# Altium schematic sheet Sheet1.SchDoc
size A4
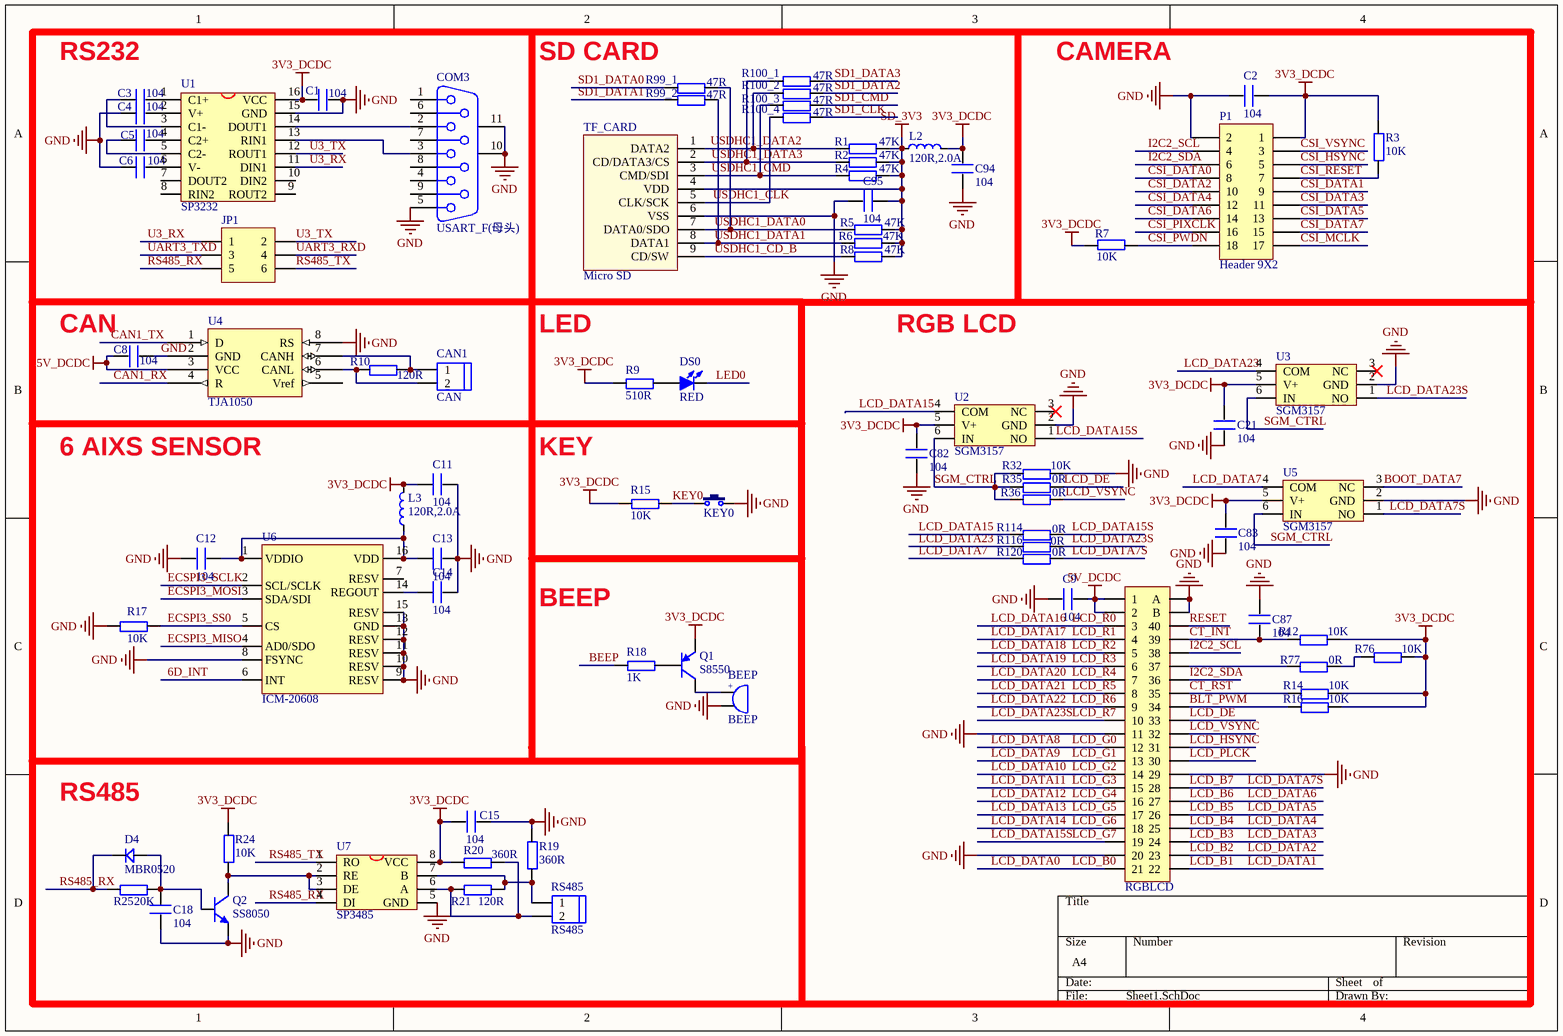
[diagram p0: Sheet1.SchDoc]

## Parts
BEEP  BEEP  [BEEP 5x9x5.5]
C1  104  [C 0603]
C2  104  [C 0603]
C3  104  [C 0603]
C4  104  [C 0603]
C5  104  [C 0603]
C6  104  [C 0603]
C8  104  [C 0603]
C9  104  [C 0603]
C11  104  [C 0603]
C12  104  [C 0603]
C13  104  [C 0603]
C14  104  [C 0603]
C15  104  [C 0603]
C18  104  [C 0603]
C21  104  [C 0603]
C82  104  [C 0603]
C83  104  [C 0603]
C87  104  [C 0603]
C94  104  [C 0603]
C95  104  [C 0603]
CAN1  CAN  [KF301-2P]
COM3  USART_F(母头)  [DB9/P_A]
D4  MBR0520  [SOD-123F]
DS0  RED  [LED 0805R]
JP1  RS232/RS485  [HDR-3X2]  (value not drawn)
KEY0  KEY  [TSW DIP-6*6*5 - 2]  (value not drawn)
L2  120R,2.0A  [L 0603]
L3  120R,2.0A  [L 0603]
P1  Header 9X2  [HDR2X9]
Q1  S8550  [SOT23-3L]
Q2  SS8050  [SOT23-3N]
R1  47K  [R 0603]
R2  47K  [R 0603]
R3  10K  [R 0603]
R4  47K  [R 0603]
R5  47K  [R 0603]
R6  47K  [R 0603]
R7  10K  [R 0603]
R8  47K  [R 0603]
R9  510R  [R 0603]
R10  120R  [R 0603]
R12  10K  [R 0603]
R14  10K  [R 0603]
R15  10K  [R 0603]
R16  10K  [R 0603]
R17  10K  [R 0603]
R18  1K  [R 0603]
R19  360R  [R 0603]
R20  360R  [R 0603]
R21  120R  [R 0603]
R24  10K  [R 0603]
R25  20K  [R 0603]
R32  10K  [R 0603]
R35  0R  [R 0603]
R36  0R  [R 0603]
R76  10K  [R 0603]
R77  0R  [R 0603]
R99_1  47R  [R 0603]
R99_2  47R  [R 0603]
R100_1  47R  [R 0603]
R100_2  47R  [R 0603]
R100_3  47R  [R 0603]
R100_4  47R  [R 0603]
R114  0R  [R 0603]
R116  0R  [R 0603]
R120  0R  [R 0603]
RGBLCD  RGBLCD  [FPC0.5-TOP40P]  (value not drawn)
RS485  RS485  [KF301-2P]
TF_CARD  Micro SD  [Micro SD]
U1  SP3232  [SOP16_N]
U2  SGM3157  [SOT363-6L]
U3  SGM3157  [SOT363-6L]
U4  TJA1050  [SOP8_N]
U5  SGM3157  [SOT363-6L]
U6  ICM-20608  [LGA-16-3*3*0.75]
U7  SP3485  [SOP8_N]

## Nets
3V3_DCDC: C1.1 C2.1 C11.1 C15.1 C21.2 C82.2 C83.2 C94.2 L2.2 L3.2 P1.1 Q1.2(E) R3.2 R7.2 R9.1 R12.2 R14.2 R15.1 R16.2 R20.1 R24.2 R76.2 U1.16(VCC) U2.5(V+) U3.5(V+) U5.5(V+) U7.8(VCC)
5V_DCDC: C8.1 C9.1 RGBLCD.1 RGBLCD.2 U4.3(VCC)
GND: BEEP.2 C1.2 C2.2 C4.1 C6.1 C8.2 C9.2 C11.2 C12.1 C13.2 C14.2 C15.2 C18.1 C21.1 C82.1 C83.1 C87.1 C94.1 C95.1 COM3.5 COM3.10(MH1) COM3.11(MH2) KEY0.2 P1.2 Q2.2(E) R17.1 R19.2 R32.2 RGBLCD.11 RGBLCD.20 RGBLCD.29 RGBLCD.41(B) RGBLCD.42(A) TF_CARD.6(VSS) U1.15(GND) U2.2(GND) U3.2(GND) U4.2(GND) U4.8(RS) U5.2(GND) U6.8(FSYNC) U6.9(RESV) U6.10(RESV) U6.11(RESV) U6.12(RESV) U6.13(GND) U6.15(RESV) U7.5(GND)
SD_3V3: C95.2 L2.1 R1.2 R2.2 R4.2 R5.2 R6.2 R8.2 TF_CARD.4(VDD)
6D_INT: U6.6(INT)
BEEP: R18.1
BLT_PWM: R16.1 RGBLCD.34
BOOT_DATA7: U5.3(NC)
CAN1_RX: U4.4(R)
CAN1_TX: U4.1(D)
CSI_DATA0: P1.8
CSI_DATA1: P1.9
CSI_DATA2: P1.10
CSI_DATA3: P1.11
CSI_DATA4: P1.12
CSI_DATA5: P1.13
CSI_DATA6: P1.14
CSI_DATA7: P1.15
CSI_HSYNC: P1.5
CSI_MCLK: P1.17
CSI_PIXCLK: P1.16
CSI_PWDN: P1.18 R7.1
CSI_RESET: P1.7 R3.1
CSI_VSYNC: P1.3
CT_INT: C87.2 R12.1 RGBLCD.39
CT_RST: R14.1 RGBLCD.35
ECSPI3_MISO: U6.4(AD0/SDO)
ECSPI3_MOSI: U6.3(SDA/SDI)
ECSPI3_SCLK: U6.2(SCL/SCLK)
ECSPI3_SS0: R17.2 U6.5(CS)
I2C2_SCL: P1.4 RGBLCD.38
I2C2_SDA: P1.6 RGBLCD.36
KEY0: KEY0.1 R15.2
LCD_B0: RGBLCD.21  [also labelled LCD_DATA0]
LCD_B1: RGBLCD.22  [also labelled LCD_DATA1]
LCD_B2: RGBLCD.23  [also labelled LCD_DATA2]
LCD_B3: RGBLCD.24  [also labelled LCD_DATA3]
LCD_B4: RGBLCD.25  [also labelled LCD_DATA4]
LCD_B5: RGBLCD.26  [also labelled LCD_DATA5]
LCD_B6: RGBLCD.27  [also labelled LCD_DATA6]
LCD_B7: R120.2 RGBLCD.28 U5.1(NO)  [also labelled LCD_DATA7S]
LCD_DATA7: R120.1 U5.4(COM)
LCD_DATA8: RGBLCD.12  [also labelled LCD_G0]
LCD_DATA9: RGBLCD.13  [also labelled LCD_G1]
LCD_DATA10: RGBLCD.14  [also labelled LCD_G2]
LCD_DATA11: RGBLCD.15  [also labelled LCD_G3]
LCD_DATA12: RGBLCD.16  [also labelled LCD_G4]
LCD_DATA13: RGBLCD.17  [also labelled LCD_G5]
LCD_DATA14: RGBLCD.18  [also labelled LCD_G6]
LCD_DATA15: R114.1 U2.4(COM)
LCD_DATA15S: R114.2 RGBLCD.19 U2.1(NO)  [also labelled LCD_G7]
LCD_DATA16: RGBLCD.3  [also labelled LCD_R0]
LCD_DATA17: RGBLCD.4  [also labelled LCD_R1]
LCD_DATA18: RGBLCD.5  [also labelled LCD_R2]
LCD_DATA19: RGBLCD.6  [also labelled LCD_R3]
LCD_DATA20: RGBLCD.7  [also labelled LCD_R4]
LCD_DATA21: RGBLCD.8  [also labelled LCD_R5]
LCD_DATA22: RGBLCD.9  [also labelled LCD_R6]
LCD_DATA23: R116.1 U3.4(COM)
LCD_DATA23S: R116.2 RGBLCD.10 U3.1(NO)  [also labelled LCD_R7]
LCD_DE: R35.2 RGBLCD.33
LCD_HSYNC: RGBLCD.31
LCD_PLCK: RGBLCD.30
LCD_VSYNC: R36.2 RGBLCD.32
LED0: DS0.2(K)
RESET: RGBLCD.40
RS485_RX: D4.2(K) JP1.5 R25.1 U7.4(DI)
RS485_TX: JP1.6 U7.1(RO)
SD1_CLK: R100_4.2
SD1_CMD: R100_3.2
SD1_DATA0: R99_1.1
SD1_DATA1: R99_2.1
SD1_DATA2: R100_2.2
SD1_DATA3: R100_1.2
SGM_CTRL: R32.1 R35.1 R36.1 U2.6(IN) U3.6(IN) U5.6(IN)
U3_RX: JP1.1 U1.11(DIN1)
U3_TX: JP1.2 U1.12(ROUT1)
UART3_RXD: JP1.4
UART3_TXD: JP1.3
USDHC1_CD_B: R8.1 TF_CARD.9(CD/SW)
USDHC1_CLK: R100_4.1 TF_CARD.5(CLK/SCK)
USDHC1_CMD: R4.1 R100_3.1 TF_CARD.3(CMD/SDI)
USDHC1_DATA0: R5.1 R99_1.2 TF_CARD.7(DATA0/SDO)
USDHC1_DATA1: R6.1 R99_2.2 TF_CARD.8(DATA1)
USDHC1_DATA2: R1.1 R100_2.1 TF_CARD.1(DATA2)
USDHC1_DATA3: R2.1 R100_1.1 TF_CARD.2(CD/DATA3/CS)
NetBEEP_1: BEEP.1 Q1.3(C)
NetC3_1: C3.1 U1.3(C1-)
NetC3_2: C3.2 U1.1(C1+)
NetC4_2: C4.2 U1.2(V+)
NetC5_1: C5.1 U1.5(C2-)
NetC5_2: C5.2 U1.4(C2+)
NetC6_2: C6.2 U1.6(V-)
NetC12_2: C12.2 C13.1 L3.1 U6.1(VDDIO) U6.16(VDD)
NetC14_1: C14.1 U6.14(REGOUT)
NetC18_2: C18.2 D4.1(A) Q2.1(B) R25.2
NetCAN1_1: CAN1.1 R10.2 U4.7(CANH)
NetCAN1_2: CAN1.2 R10.1 U4.6(CANL)
NetCOM3_2: COM3.2 U1.14(DOUT1)
NetCOM3_3: COM3.3 U1.13(RIN1)
NetDS0_1: DS0.1(A) R9.2
NetQ1_1: Q1.1(B) R18.2
NetQ2_3: Q2.3(C) R24.1 U7.2(RE) U7.3(DE)
NetR19_1: R19.1 R21.2 RS485.1 U7.7(B)
NetR20_2: R20.2 R21.1 RS485.2 U7.6(A)
NetR76_1: R76.1 R77.2
NetR77_1: R77.1 RGBLCD.37

Not connected (* = marked no-connect by the designer): COM3 1 4 6 7 8 9; U1 7(DOUT2) 8(RIN2) 9(ROUT2) 10(DIN2); U2 3(NC)*; U3 3(NC)*; U4 5(Vref); U6 7(RESV)

## Notes on the sheet
- RS232
- SD CARD
- CAMERA
- (near C8) CAN
- LED
- RGB LCD
- 6 AIXS SENSOR
- KEY
- BEEP
- (near D4) RS485
- (in symbol BEEP) +

## Library data of the parts
BEEP = BEEP: 蜂鸣器; 版权归属: 源创客; BOM名称: 蜂鸣器; 学习资源: www.ooocke.com
C1-C6 C8 C9 C11-C15 C18 C21 C82 C83 C87 C94 C95 = C
CAN1 RS485 = HEAD2
COM3 = DB9: 9针串口; 版权归属: 源创客; BOM名称: 9针串口; 学习资源: www.ooocke.com
D4 = SS14: 肖特基二极管; 版权归属: 源创客; 属性: 40V/1A; BOM名称: 肖特基二极管; 学习资源: www.ooocke.com
DS0 = LED-SMD: 贴片LED; 版权归属: 源创客; BOM名称: 贴片LED; 学习资源: www.ooocke.com
JP1 = Header 3X2: 3*2P接插件; 版权归属: 源创客; BOM名称: 3*2P接插件; 学习资源: www.ooocke.com
KEY0 = KEY: 按键; BOM名称: 3x6轻触开关; 版权归属: 源创客; 学习资源: www.ooocke.com
L2 L3 = L: 小功率贴片电感磁珠; 版权归属: 源创客; BOM名称: 小功率贴片电感; 学习资源: www.ooocke.com
P1 = Header 9X2: Header, 9-Pin, Dual row; LatestRevisionDate: 17-Jul-2002; LatestRevisionNote: Re-released for DXP Platform.; Publisher: Altium Limited
Q1 = 8550-SMD: 高频放大-PNP型; 版权归属: 源创客; 属性: 40V 1.5A 1W 100MHZ; BOM名称: 高频放大-PNP型; 学习资源: www.ooocke.com
Q2 = 8050-SMD: 高频放大-NPN型; 版权归属: 源创客; 属性: 40V 1.5A 1W 100MHZ; BOM名称: 高频放大-NPN型; 学习资源: www.ooocke.com
R1-R10 R12 R14-R21 R24 R25 R32 R35 R36 R76 R77 R99_1 R99_2 R100_1-R100_4 R114 R116 R120 = R
RGBLCD = RGBLCD: 16*2P接插件; 版权归属: 源创客; BOM名称: 16*2P接插件; 学习资源: www.ooocke.com
TF_CARD = Micro SD: Micro SD卡; 版权归属: 源创客; BOM名称: Micro SD卡; 学习资源: www.ooocke.com
U1 = MAX3232
U2 U3 U5 = SGM3157: 单路双掷模拟开关
U4 = SN65HVD230D
U6 = ICM20608: 三轴陀螺仪/三轴加速度计,
U7 = MAX3485